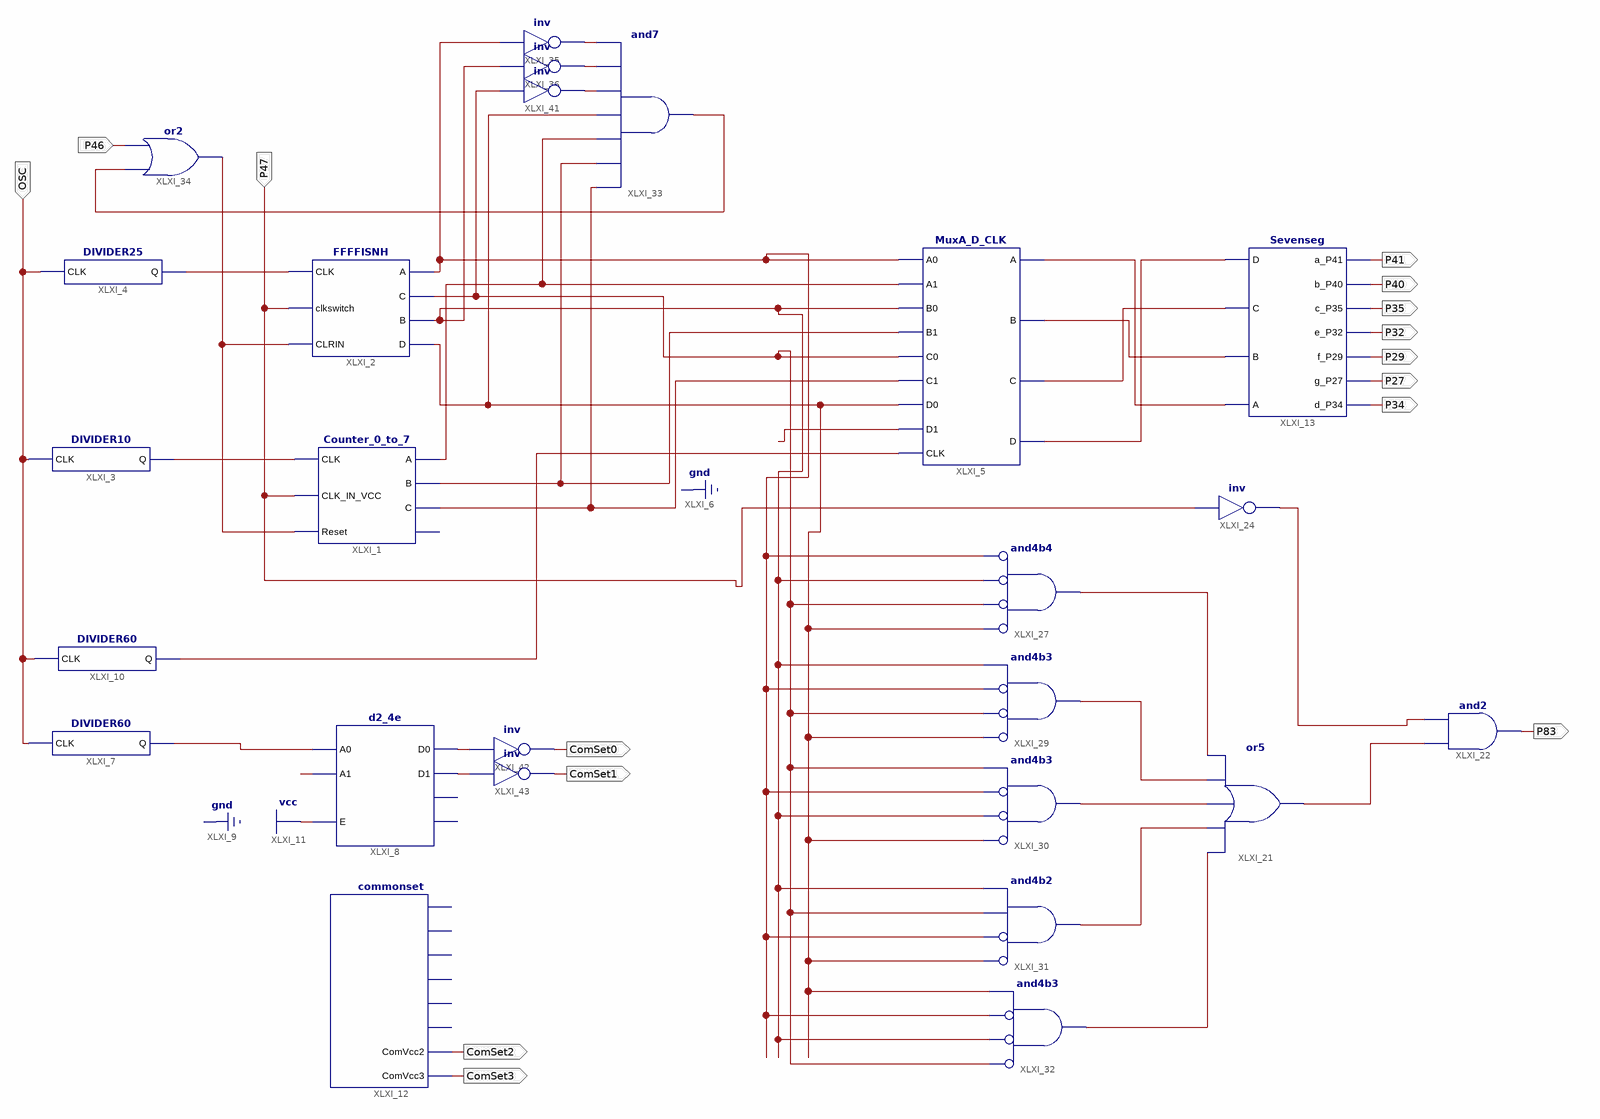
[diagram p0: schematic sheet 1]
// Xilinx ISE schematic Test0077.sch (spartan6) as structural Verilog: 25 symbols, 15 ports
module Test0077 (
  input  P47,
  input  OSC,
  input  P46,
  output ComSet2,
  output ComSet3,
  output P41,
  output P40,
  output P35,
  output P32,
  output P29,
  output P27,
  output P34,
  output P83,
  output ComSet0,
  output ComSet1
);

  wire XLXN_4, XLXN_5, XLXN_26, XLXN_27, XLXN_35, XLXN_36, XLXN_37, XLXN_38, XLXN_69, XLXN_70, XLXN_71,
       XLXN_73, XLXN_74, XLXN_79, XLXN_80, XLXN_97, XLXN_102, XLXN_103, XLXN_104, XLXN_105, XLXN_106,
       XLXN_107, XLXN_108, XLXN_109, XLXN_110, XLXN_111, XLXN_112, XLXN_113, XLXN_114;

  Counter_0_to_7 XLXI_1 (
    .CLK(XLXN_5), .CLK_IN_VCC(P47), .Reset(XLXN_97), .A(XLXN_109), .B(XLXN_110), .C(XLXN_111));  // open: TC
  FFFFISNH XLXI_2 (
    .CLK(XLXN_4), .clkswitch(P47), .CLRIN(XLXN_97), .A(XLXN_105), .C(XLXN_107), .B(XLXN_106), .D(XLXN_108));
  DIVIDER10 XLXI_3 (.CLK(OSC), .Q(XLXN_5));
  DIVIDER25 XLXI_4 (.CLK(OSC), .Q(XLXN_4));
  MuxA_D_CLK XLXI_5 (
    .A0(XLXN_105), .A1(XLXN_109), .B0(XLXN_106), .B1(XLXN_110), .C0(XLXN_107), .C1(XLXN_111), .D0(XLXN_108),
    .D1(1'b0), .CLK(XLXN_27), .A(XLXN_35), .B(XLXN_36), .C(XLXN_37), .D(XLXN_38));
  DIVIDER60 XLXI_7 (.CLK(OSC), .Q(XLXN_26));
  d2_4e XLXI_8 (.A0(XLXN_26), .A1(1'b0), .E(1'b1), .D0(XLXN_113), .D1(XLXN_114));  // open: D2, D3
  DIVIDER60 XLXI_10 (.CLK(OSC), .Q(XLXN_27));
  commonset XLXI_12 (
    .ComVcc2(ComSet2), .ComVcc3(ComSet3));  // open: ComGnd0, ComGnd1, ComGnd2, ComGnd3, ComVcc0, ComVcc1
  Sevenseg XLXI_13 (
    .D(XLXN_38), .C(XLXN_37), .B(XLXN_36), .A(XLXN_35), .a_P41(P41), .b_P40(P40), .c_P35(P35), .e_P32(P32),
    .f_P29(P29), .g_P27(P27), .d_P34(P34));
  not XLXI_24 (XLXN_79, P47);
  or XLXI_21 (XLXN_80, XLXN_74, XLXN_73, XLXN_71, XLXN_70, XLXN_69);
  and XLXI_22 (P83, XLXN_80, XLXN_79);
  and XLXI_27 (XLXN_69, ~XLXN_108, ~XLXN_107, ~XLXN_106, ~XLXN_105);  // and4b4
  and XLXI_29 (XLXN_70, ~XLXN_108, ~XLXN_107, ~XLXN_105, XLXN_106);  // and4b3
  and XLXI_30 (XLXN_71, ~XLXN_108, ~XLXN_106, ~XLXN_105, XLXN_107);  // and4b3
  and XLXI_31 (XLXN_73, ~XLXN_108, ~XLXN_105, XLXN_107, XLXN_106);  // and4b2
  and XLXI_32 (XLXN_74, ~XLXN_107, ~XLXN_106, ~XLXN_105, XLXN_108);  // and4b3
  and XLXI_33 (XLXN_112, XLXN_111, XLXN_110, XLXN_109, XLXN_108, XLXN_104, XLXN_103, XLXN_102);
  or XLXI_34 (XLXN_97, XLXN_112, P46);
  not XLXI_35 (XLXN_102, XLXN_105);
  not XLXI_36 (XLXN_103, XLXN_106);
  not XLXI_41 (XLXN_104, XLXN_107);
  not XLXI_42 (ComSet0, XLXN_113);
  not XLXI_43 (ComSet1, XLXN_114);
endmodule
